# Altium schematic sheet Control_Panel_Part2.SchDoc: Наименование
size 420 x 297 mm; ApprovedBy: Сидоров; CheckedBy: Петров; Author: Иванов; CompanyName: РГППУ; Title2str: Изделия; DecimalNumber: АБВГ.123456.001 33
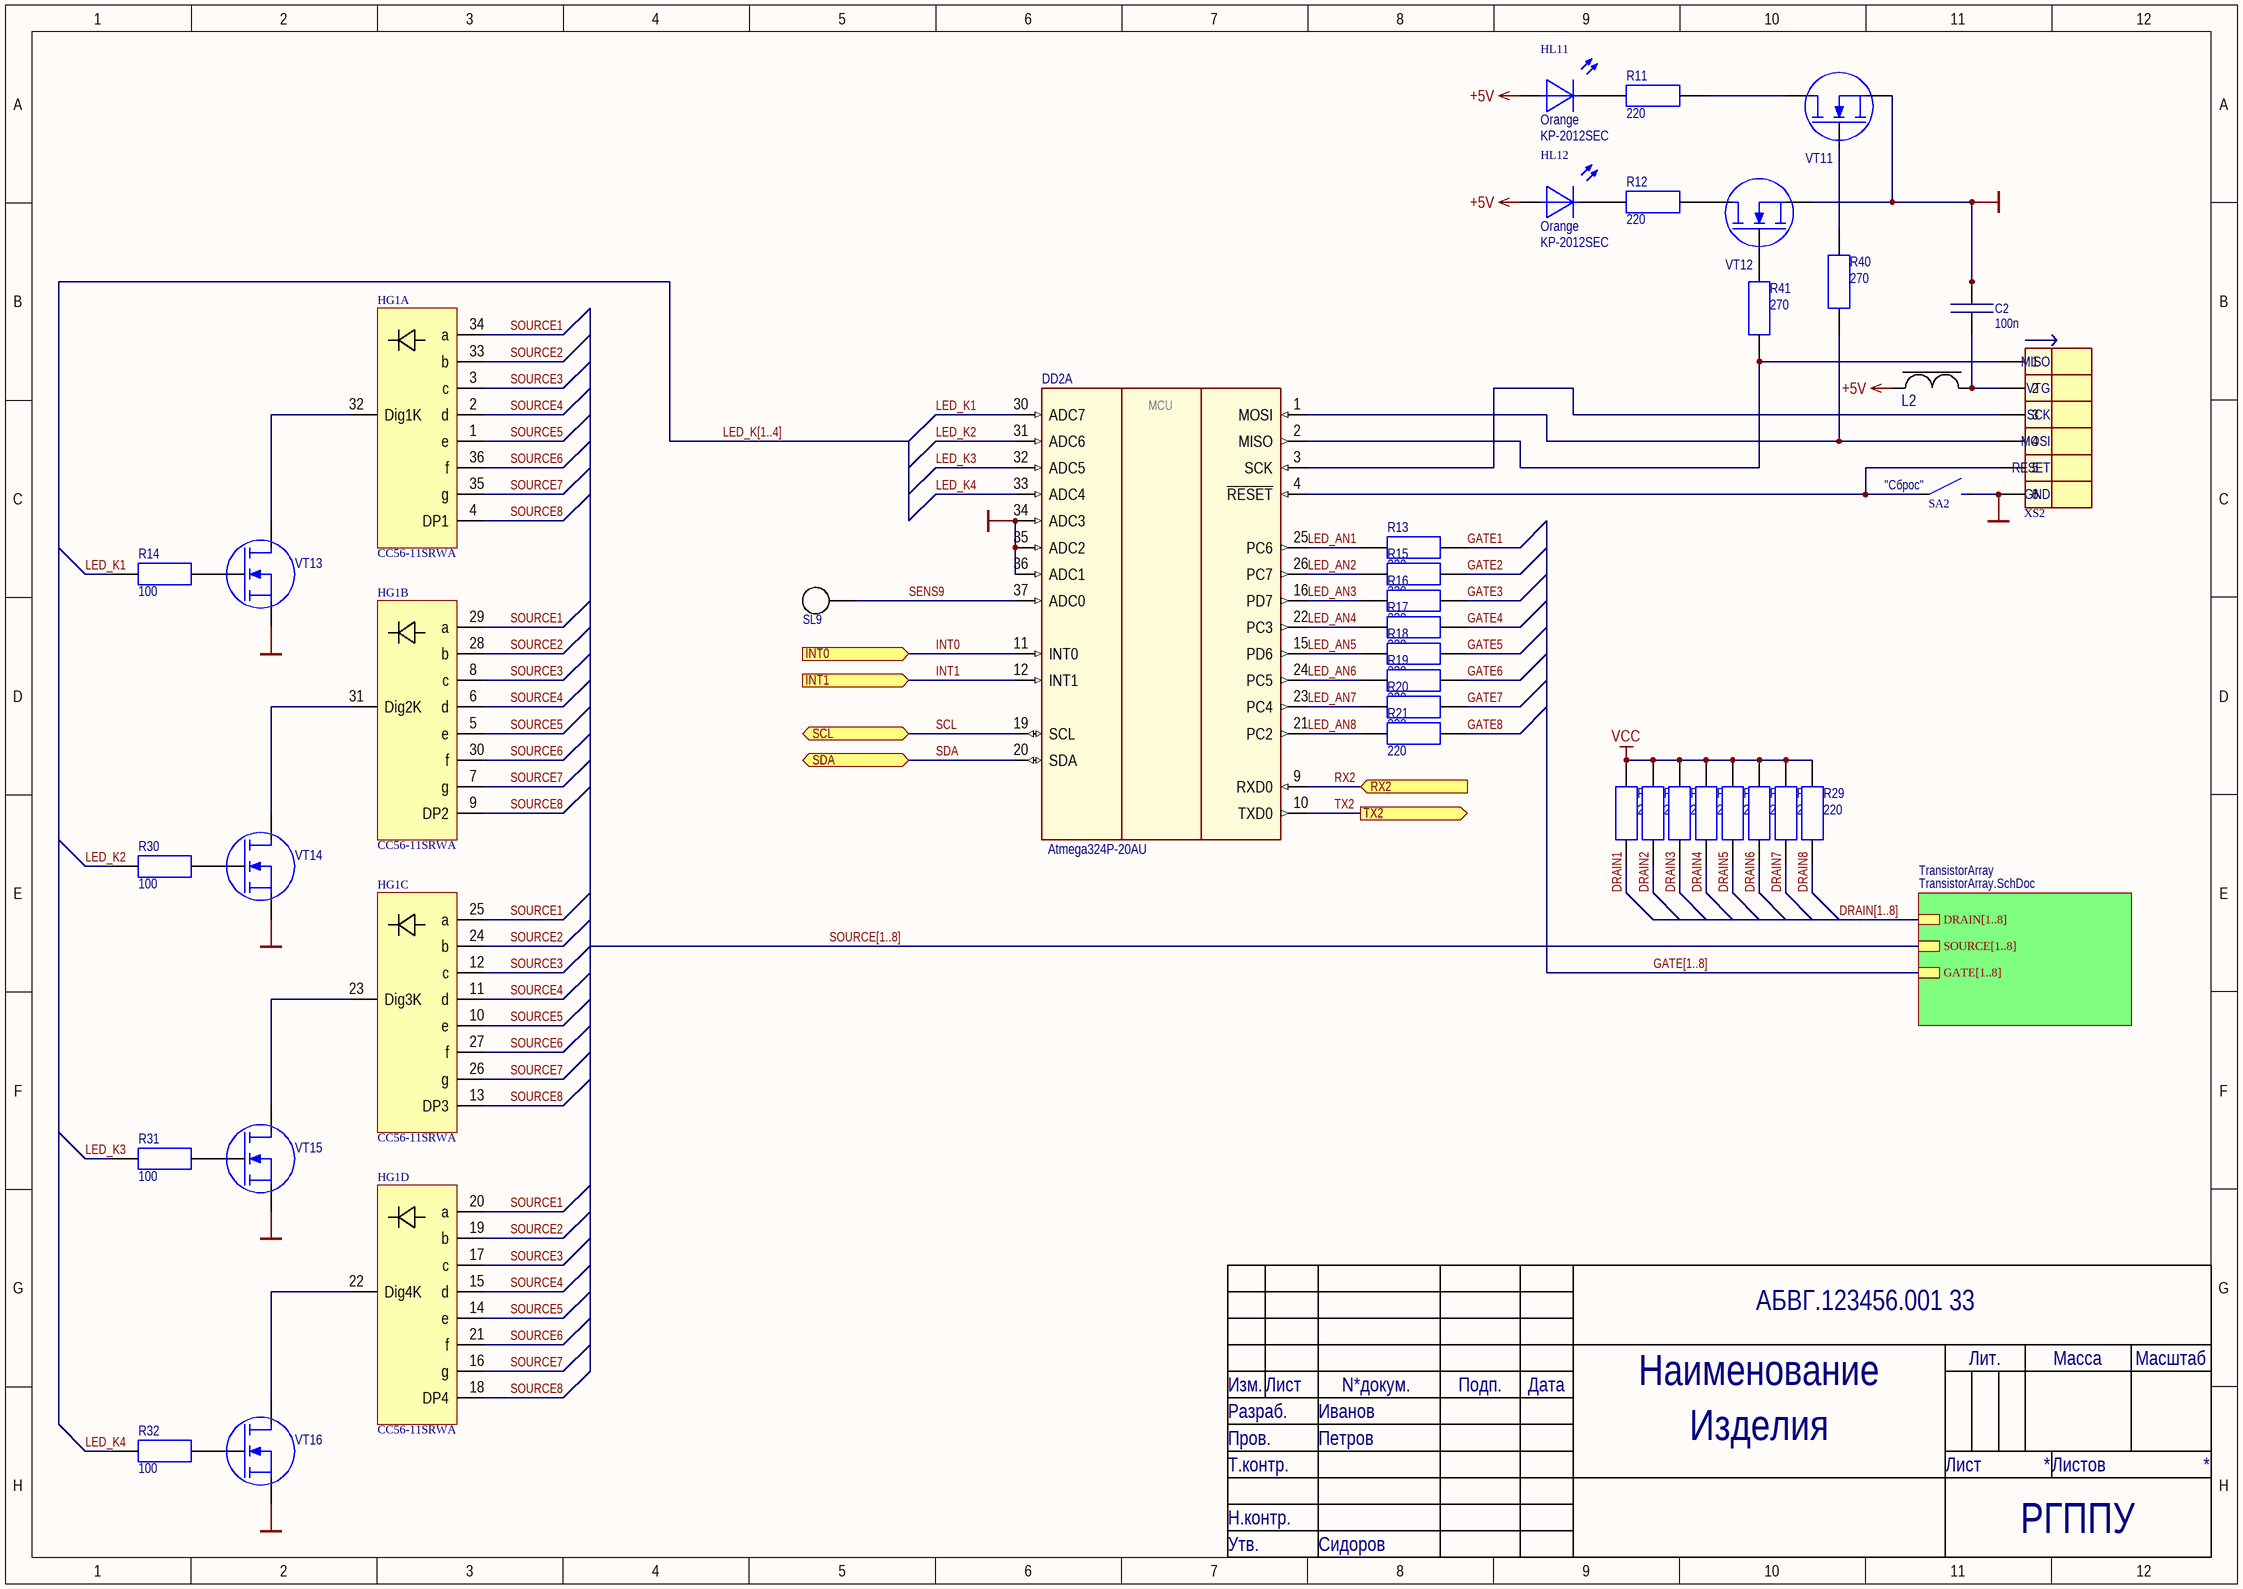
[diagram p0: Control_Panel_Part2.SchDoc]

## Parts
C2  100n  [SMDRC0805]
DD2  Atmega324P-20AU  [44ML_M]  (part A of 2)
HG1  CC56-11SRWA  [CC56-11SRWA]  (parts A,B,C,D of 4)
HL11  Orange  ManufacturerPartNumber: KP-2012SEC  [DIOMELF2012M]
HL12  Orange  ManufacturerPartNumber: KP-2012SEC  [DIOMELF2012M]
L2  MPZ1608S181A  [INDC0603X03M]  (value not drawn)
R11  220  [SMDRC0805]
R12  220  [SMDRC0805]
R13  220  [SMDRC0805]
R14  100  [SMDRC0805]
R15  220  [SMDRC0805]
R16  220  [SMDRC0805]
R17  220  [SMDRC0805]
R18  220  [SMDRC0805]
R19  220  [SMDRC0805]
R20  220  [SMDRC0805]
R21  220  [SMDRC0805]
R22  220  [SMDRC0805]
R23  220  [SMDRC0805]
R24  220  [SMDRC0805]
R25  220  [SMDRC0805]
R26  220  [SMDRC0805]
R27  220  [SMDRC0805]
R28  220  [SMDRC0805]
R29  220  [SMDRC0805]
R30  100  [SMDRC0805]
R31  100  [SMDRC0805]
R32  100  [SMDRC0805]
R40  270  [SMDRC0805]
R41  270  [SMDRC0805]
SA2  DTSM20-4.3  [DTSM20]  (value not drawn)
SL9  Touch_sensor  [Bolt 6mm]  (value not drawn)
VT11  2N7002  [SOT23 (TO-236AB)]  (value not drawn)
VT12  2N7002  [SOT23 (TO-236AB)]  (value not drawn)
VT13  2N7002  [SOT23 (TO-236AB)]  (value not drawn)
VT14  2N7002  [SOT23 (TO-236AB)]  (value not drawn)
VT15  2N7002  [SOT23 (TO-236AB)]  (value not drawn)
VT16  2N7002  [SOT23 (TO-236AB)]  (value not drawn)
XS2  IDC-06M  [IDC-06M]  (value not drawn)

## Sub-sheets
TransistorArray = TransistorArray.SchDoc: DRAIN[1..8], SOURCE[1..8], GATE[1..8]

## Ports
INT0 (in), INT1 (in), RX2 (in), SCL (bidir), SDA (bidir), TX2 (out)

## Nets
+5V: HL11.1 HL12.1 L2.1
GND: C2.2 DD2.34(ADC3) DD2.35(ADC2) DD2.36(ADC1) SA2.2 VT11.2(S) VT12.2(S) VT13.2(S) VT14.2(S) VT15.2(S) VT16.2(S) XS2.6
VCC: R22.2 R23.2 R24.2 R25.2 R26.2 R27.2 R28.2 R29.2
DRAIN1: R22.1
DRAIN2: R23.1
DRAIN3: R24.1
DRAIN4: R25.1
DRAIN5: R26.1
DRAIN6: R27.1
DRAIN7: R28.1
DRAIN8: R29.1
GATE1: R13.2
GATE2: R15.2
GATE3: R16.2
GATE4: R17.2
GATE5: R18.2
GATE6: R19.2
GATE7: R20.2
GATE8: R21.2
INT0: DD2.11(INT0) ; port INT0
INT1: DD2.12(INT1) ; port INT1
LED_AN1: DD2.25(PC6) R13.1
LED_AN2: DD2.26(PC7) R15.1
LED_AN3: DD2.16(PD7) R16.1
LED_AN4: DD2.22(PC3) R17.1
LED_AN5: DD2.15(PD6) R18.1
LED_AN6: DD2.24(PC5) R19.1
LED_AN7: DD2.23(PC4) R20.1
LED_AN8: DD2.21(PC2) R21.1
LED_K1: DD2.30(ADC7) R14.1
LED_K2: DD2.31(ADC6) R30.1
LED_K3: DD2.32(ADC5) R31.1
LED_K4: DD2.33(ADC4) R32.1
RX2: DD2.9(RXD0) ; port RX2
SCL: DD2.19(SCL) ; port SCL
SDA: DD2.20(SDA) ; port SDA
SENS9: DD2.37(ADC0) SL9.1
SOURCE1: HG1.20(a) HG1.25(a) HG1.29(a) HG1.34(a)
SOURCE2: HG1.19(b) HG1.24(b) HG1.28(b) HG1.33(b)
SOURCE3: HG1.3(c) HG1.8(c) HG1.12(c) HG1.17(c)
SOURCE4: HG1.2(d) HG1.6(d) HG1.11(d) HG1.15(d)
SOURCE5: HG1.1(e) HG1.5(e) HG1.10(e) HG1.14(e)
SOURCE6: HG1.21(f) HG1.27(f) HG1.30(f) HG1.36(f)
SOURCE7: HG1.7(g) HG1.16(g) HG1.26(g) HG1.35(g)
SOURCE8: HG1.4(DP1) HG1.9(DP2) HG1.13(DP3) HG1.18(DP4)
TX2: DD2.10(TXD0) ; port TX2
NetC2_1: C2.1 L2.2 XS2.2
NetDD2_1: DD2.1(MOSI) R40.1 XS2.4
NetDD2_2: DD2.2(MISO) R41.1 XS2.1
NetDD2_3: DD2.3(SCK) XS2.3
NetDD2_4: DD2.4(~{RESET}) SA2.1 XS2.5
NetHG1_22: HG1.22(Dig4K) VT16.3(D)
NetHG1_23: HG1.23(Dig3K) VT15.3(D)
NetHG1_31: HG1.31(Dig2K) VT14.3(D)
NetHG1_32: HG1.32(Dig1K) VT13.3(D)
NetHL11_2: HL11.2 R11.2
NetHL12_2: HL12.2 R12.2
NetR11_1: R11.1 VT11.3(D)
NetR12_1: R12.1 VT12.3(D)
NetR14_2: R14.2 VT13.1(G)
NetR30_2: R30.2 VT14.1(G)
NetR31_2: R31.2 VT15.1(G)
NetR32_2: R32.2 VT16.1(G)
NetR40_2: R40.2 VT11.1(G)
NetR41_2: R41.2 VT12.1(G)

## Buses and harness runs
bus DRAIN[1..8] = sheet TransistorArray/DRAIN[1..8]
bus GATE[1..8] = sheet TransistorArray/GATE[1..8]
bus LED_K[1..4]
bus SOURCE[1..8] = sheet TransistorArray/SOURCE[1..8]

## Notes on the sheet
- (near SA2) "Сброс"
- Изм.
- Лист
- N*докум.
- Подп.
- Дата
- Лит.
- Масса
- Масштаб
- Разраб.
- Пров.
- Т.контр.
- Лиcт
- Лиcтов
- Н.контр.
- Утв.
- (in symbol Atmega324P-20AU, part A) MCU
- (in symbol Con6_M IDC-06M_SPI) MISO; VTG; SCK; MOSI; RESET; GND

## Library data of the parts
C2 = Capacitor 0805 100n: Generic capasitor non-polar; PartNumber: Capacitor 0805 100n; Value: 100n; ComponentLink1Description: Datasheet; Package: 0805
DD2 = Atmega324P-20AU: Microcontroller 8-bit; Manufacturer: Atmel; ComponentLink1URL: http://www.atmel.com/Images/Atmel-8011-8-bit-AVR-Microcontroller-ATmega164P-324P-644P_datasheet.pdf; ComponentLink1Description: Datasheet; Cost: 220; Package: TQFP-44; Supplier: Промэлектроника; ManufacturerPartNumber: Atmega324P-20AU
HG1 = CC56-11SRWA: The Super Bright Red source color devices are made with  Gallium Aluminum Arsenide Red Light Emitting Diode.; Manufacturer: Kingbright; ComponentLink1Description: Datasheet; ComponentLink1URL: http://lib.chipdip.ru/195/DOC000195478.pdf; Cost: 151.88; ManufacturerPartNumber: CC56-11SRWA; Notes: *; Package: not standard; Supplier: Промэлектроника
HL11 HL12 = LED1_O: Diod LED SMD Orange; ComponentLink1Description: Datasheet; Cost: 4,91; ComponentLink2Description: Datasheet-local; ComponentLink2URL: *; Color: Orange
L2 = Ferrite Bead: Value: ? мГн; ManufacturerPartNumber: MPZ1608S181A; ComponentLink1Description: Datasheet; Supplier: Промэлектроника; ComponentLink2Description: Datasheet-local; ComponentLink2URL: *
R11-R13 R15-R29 = Resistor 0805 220: Generic resistor; PartNumber: Resistor 0805 220; Value: 220; ComponentLink1URL: http://www.mouser.com/ds/2/447/PYu-RC0402_51_RoHS_L_6_r-8721.pdf; ComponentLink1Description: Datasheet; Package: 0805
R14 R30-R32 = Resistor 0805 100: Generic resistor; PartNumber: Resistor 0805 100; Value: 100; ComponentLink1URL: http://www.mouser.com/ds/2/447/PYu-RC0402_51_RoHS_L_6_r-8721.pdf; ComponentLink1Description: Datasheet; Package: 0805
R40 R41 = Resistor 0805 270: Generic resistor; PartNumber: Resistor 0805 270; Value: 270; ComponentLink1URL: http://www.mouser.com/ds/2/447/PYu-RC0402_51_RoHS_L_6_r-8721.pdf; ComponentLink1Description: Datasheet; Package: 0805
SA2 = Switch1_DTSM20-4.3: Switch open; Manufacturer: Diptronics; ManufacturerPartNumber: DTSM20-4.3; ComponentLink1Description: Datasheet; ComponentLink1URL: http://www.promelec.ru/catalog/407/1291/1323/1/70721/; ComponentLink2Description: Datasheet-local; ComponentLink2URL: *
SL9 = Touch_sensor: Bolt touch sensor
VT11-VT16 = 2N7002 n-MOSFET: 60V, 300mA N-channel Trench MOSFET; ManufacturerPartNumber: 2N7002
XS2 = Con6_M IDC-06M_SPI: SPI connector; ManufacturerPartNumber: IDC-06M; ComponentLink1Description: Datasheet; ComponentLink1URL: http://www.promelec.ru/catalog/406/1218/1223/1/156430/; ComponentLink2Description: Datasheet-local; ComponentLink2URL: *